# Altium schematic sheet Sheet1.SchDoc
size A4
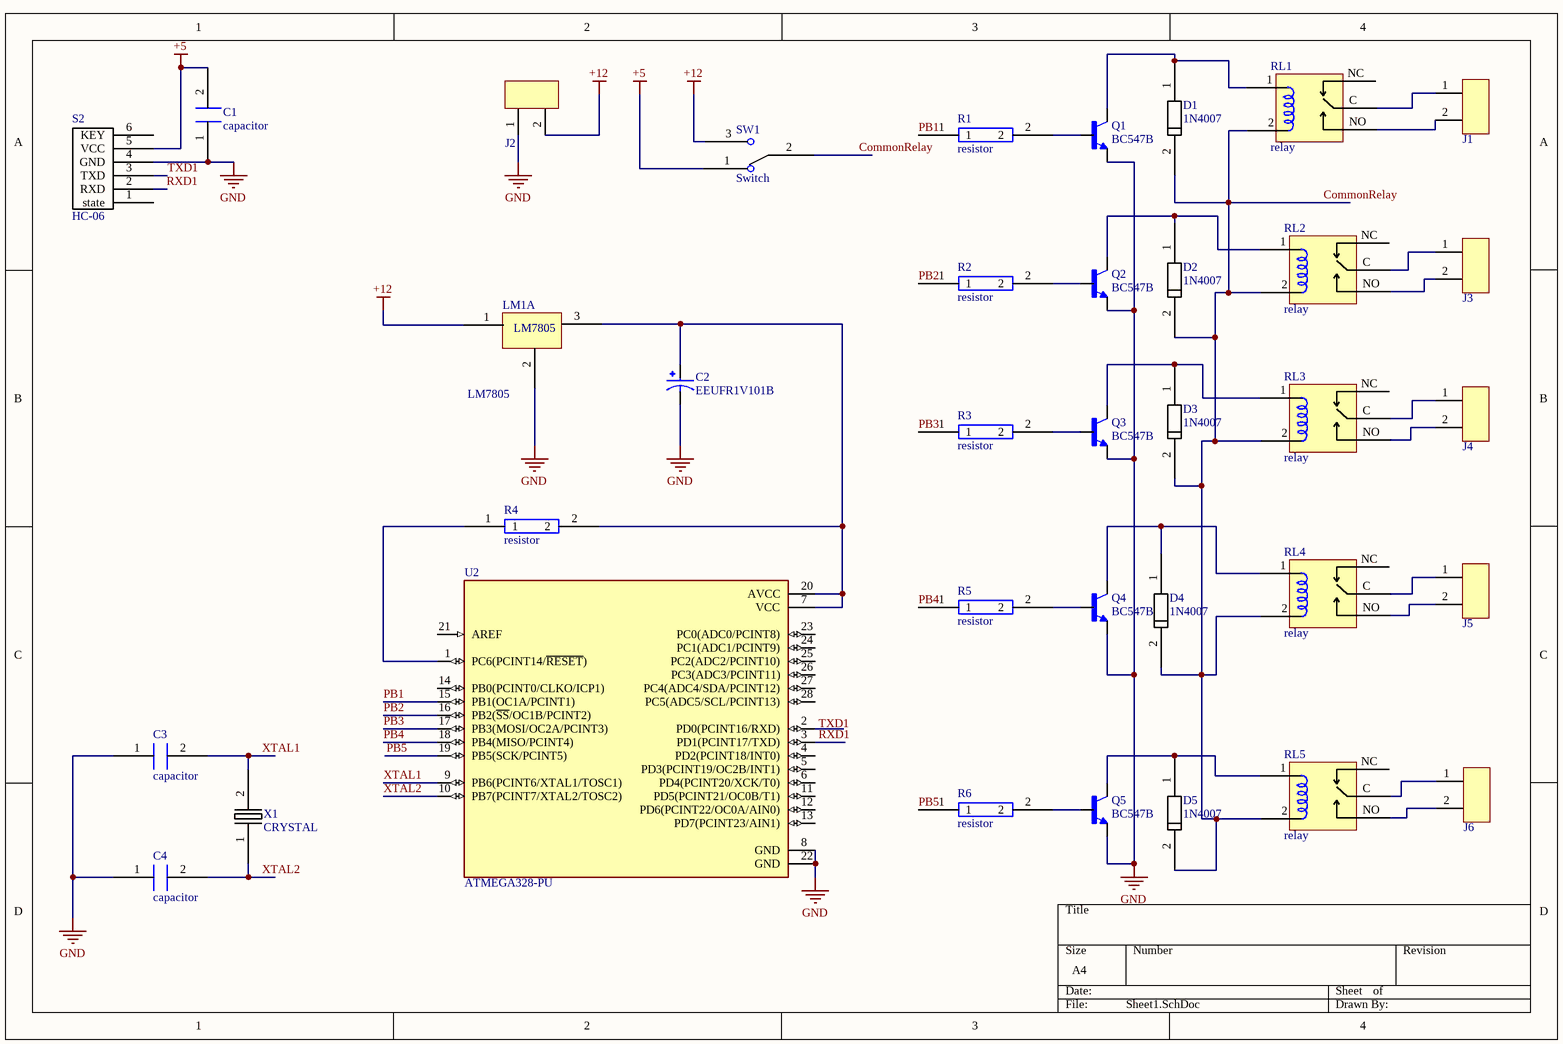
[diagram p0: Sheet1.SchDoc]

## Parts
C1  capacitor  [Capacitor]
C2  EEUFR1V101B  [CAPPRD350W60D800H1150]
C3  capacitor  [Capacitor]
C4  capacitor  [Capacitor]
D1  1N4007  [1N4007]
D2  1N4007  [1N4007]
D3  1N4007  [1N4007]
D4  1N4007  [1N4007]
D5  1N4007  [1N4007]
J1  TBP01R1-508-02BE  [TBP01R1-508]  (value not drawn)
J2  TBP01R1-508-02BE  [TBP01R1-508]  (value not drawn)
J3  TBP01R1-508-02BE  [TBP01R1-508]  (value not drawn)
J4  TBP01R1-508-02BE  [TBP01R1-508]  (value not drawn)
J5  TBP01R1-508-02BE  [TBP01R1-508]  (value not drawn)
J6  TBP01R1-508-02BE  [TBP01R1-508]  (value not drawn)
LM1  LM7805  [LM7805]  (part A of 5)
Q1  BC547B  [TO92250P510H770-3]
Q2  BC547B  [TO92250P510H770-3]
Q3  BC547B  [TO92250P510H770-3]
Q4  BC547B  [TO92250P510H770-3]
Q5  BC547B  [TO92250P510H770-3]
R1  resistor  [res]
R2  resistor  [res]
R3  resistor  [res]
R4  resistor  [res]
R5  resistor  [res]
R6  resistor  [res]
RL1  relay  [relay]
RL2  relay  [relay]
RL3  relay  [relay]
RL4  relay  [relay]
RL5  relay  [relay]
S2  HC-06  [HC-06]
SW1  Switch  [toggle switch]
U2  ATMEGA328-PU  [DIP787W46P254L3467H508Q28]
X1  CRYSTAL  [CRYSTAL]

## Nets
+5: C1.2 S2.5(VCC) SW1.1
+12: J2.2 LM1.1(in) SW1.3
GND: C1.1 C2.N C3.1 C4.1 J2.1 LM1.2(GND) Q1.3(E) Q2.3(E) Q3.3(E) Q4.3(E) Q5.3(E) S2.4(GND) U2.8(GND) U2.22(GND)
CommonRelay: D1.2(katot) D2.2(katot) D3.2(katot) D4.2(katot) D5.2(katot) RL1.2 RL2.2 RL3.2 RL4.2 RL5.2 SW1.2
PB1: R1.1 U2.15(PB1(OC1A/PCINT1))
PB2: R2.1 U2.16(PB2(~{SS}/OC1B/PCINT2))
PB3: R3.1 U2.17(PB3(MOSI/OC2A/PCINT3))
PB4: R5.1 U2.18(PB4(MISO/PCINT4))
PB5: R6.1 U2.19(PB5(SCK/PCINT5))
RXD1: S2.2(RXD) U2.3(PD1(PCINT17/TXD))
TXD1: S2.3(TXD)
XTAL1: C3.2 U2.9(PB6(PCINT6/XTAL1/TOSC1)) X1.2
XTAL2: C4.2 U2.10(PB7(PCINT7/XTAL2/TOSC2)) X1.1
NetC2_P: C2.P LM1.3(out) R4.2 U2.7(VCC) U2.20(AVCC)
NetD1_1: D1.1(anot) Q1.1(C) RL1.1
NetD2_1: D2.1(anot) Q2.1(C) RL2.1
NetD3_1: D3.1(anot) Q3.1(C) RL3.1
NetD4_1: D4.1(anot) Q4.1(C) RL4.1
NetD5_1: D5.1(anot) Q5.1(C) RL5.1
NetJ1_1: J1.1 RL1.C
NetJ1_2: J1.2 RL1.NO
NetJ3_1: J3.1 RL2.C
NetJ3_2: J3.2 RL2.NO
NetJ4_1: J4.1 RL3.C
NetJ4_2: J4.2 RL3.NO
NetJ5_1: J5.1 RL4.C
NetJ5_2: J5.2 RL4.NO
NetJ6_1: J6.1 RL5.C
NetJ6_2: J6.2 RL5.NO
NetQ1_2: Q1.2(B) R1.2
NetQ2_2: Q2.2(B) R2.2
NetQ3_2: Q3.2(B) R3.2
NetQ4_2: Q4.2(B) R5.2
NetQ5_2: Q5.2(B) R6.2
NetR4_1: R4.1 U2.1(PC6(PCINT14/~{RESET}))

Not connected (* = marked no-connect by the designer): RL1 NC; RL2 NC; RL3 NC; RL4 NC; RL5 NC; S2 1(state) 6(KEY); U2 2(PD0(PCINT16/RXD)) 4(PD2(PCINT18/INT0)) 5(PD3(PCINT19/OC2B/INT1)) 6(PD4(PCINT20/XCK/T0)) 11(PD5(PCINT21/OC0B/T1)) 12(PD6(PCINT22/OC0A/AIN0)) 13(PD7(PCINT23/AIN1)) 14(PB0(PCINT0/CLKO/ICP1)) 21(AREF) 23(PC0(ADC0/PCINT8)) 24(PC1(ADC1/PCINT9)) 25(PC2(ADC2/PCINT10)) 26(PC3(ADC3/PCINT11)) 27(PC4(ADC4/SDA/PCINT12)) 28(PC5(ADC5/SCL/PCINT13))

## Notes on the sheet
- Labels drawn without touching a wire or pin: TXD1

## Library data of the parts
C2 = EEUFR1V101B: AL LYTIC, RADIAL, 35VDC, 100UF; MF: Panasonic; MP: EEUFR1V101B; Value: *; Check_prices: https://www.snapeda.com/parts/EEUFR1V101B/Panasonic/view-part/5790218/?ref=eda; SnapEDA_Link: https://www.snapeda.com/parts/EEUFR1V101B/Panasonic/view-part/5790218/?ref=snap; Price: None; Availability: In Stock; Package: RADIAL-2 Panasonic
J1-J6 = TBP01R1-508-02BE: Conn Shrouded Header HDR 2 POS 5.08mm Solder RA Side Entry Thru-Hole Bag; Manufacturer: CUI; Designed by: BERK; Supplier 1: Digi-Key; Manufacturer Part Number: TBP01R1-508-02BE; RoHS: No; Stock 1: 3398; Pricing 1: 1=0,50000, 10=0,26500, 25=0,18760, 50=0,15960, 100=0,15400, 250=0,13020, 500=0,12040, 1000=0,10640, 5000=0,08120 (USD); Supplier Part Number 1: 102-6406-ND
Q1-Q5 = BC547B: Bipolar (BJT) Transistor NPN 45 V 100 mA 300MHz 625 mW Through Hole TO-92 (TO-226); MF: ON Semiconductor; Availability: In Stock; Price: None; SnapEDA_Link: https://www.snapeda.com/parts/BC547B/Onsemi/view-part/?ref=snap; Purchase-URL: https://pricing.snapeda.com/search/part/BC547B/?ref=eda; Value: *; Check_prices: https://www.snapeda.com/parts/BC547B/Onsemi/view-part/?ref=eda; Package: TO-92-3 ON Semiconductor; MP: BC547B
U2 = ATMEGA328-PU: AVR AVRÂ® ATmega Microcontroller IC 8-Bit 20MHz 32KB (16K x 16) FLASH 28-PDIP; MF: Microchip Technology; Value: *; Package: DIP-28 Microchip Technology; Availability: In Stock; Check_prices: https://www.snapeda.com/parts/ATMEGA328-PU/Microchip/view-part/?ref=eda; SnapEDA_Link: https://www.snapeda.com/parts/ATMEGA328-PU/Microchip/view-part/?ref=snap; Purchase-URL: https://pricing.snapeda.com/search/part/ATMEGA328-PU/?ref=eda; MP: ATMEGA328-PU; Price: None